# EAGLE design controller-ha-v4-rev1 (EAGLE 6.5.0)
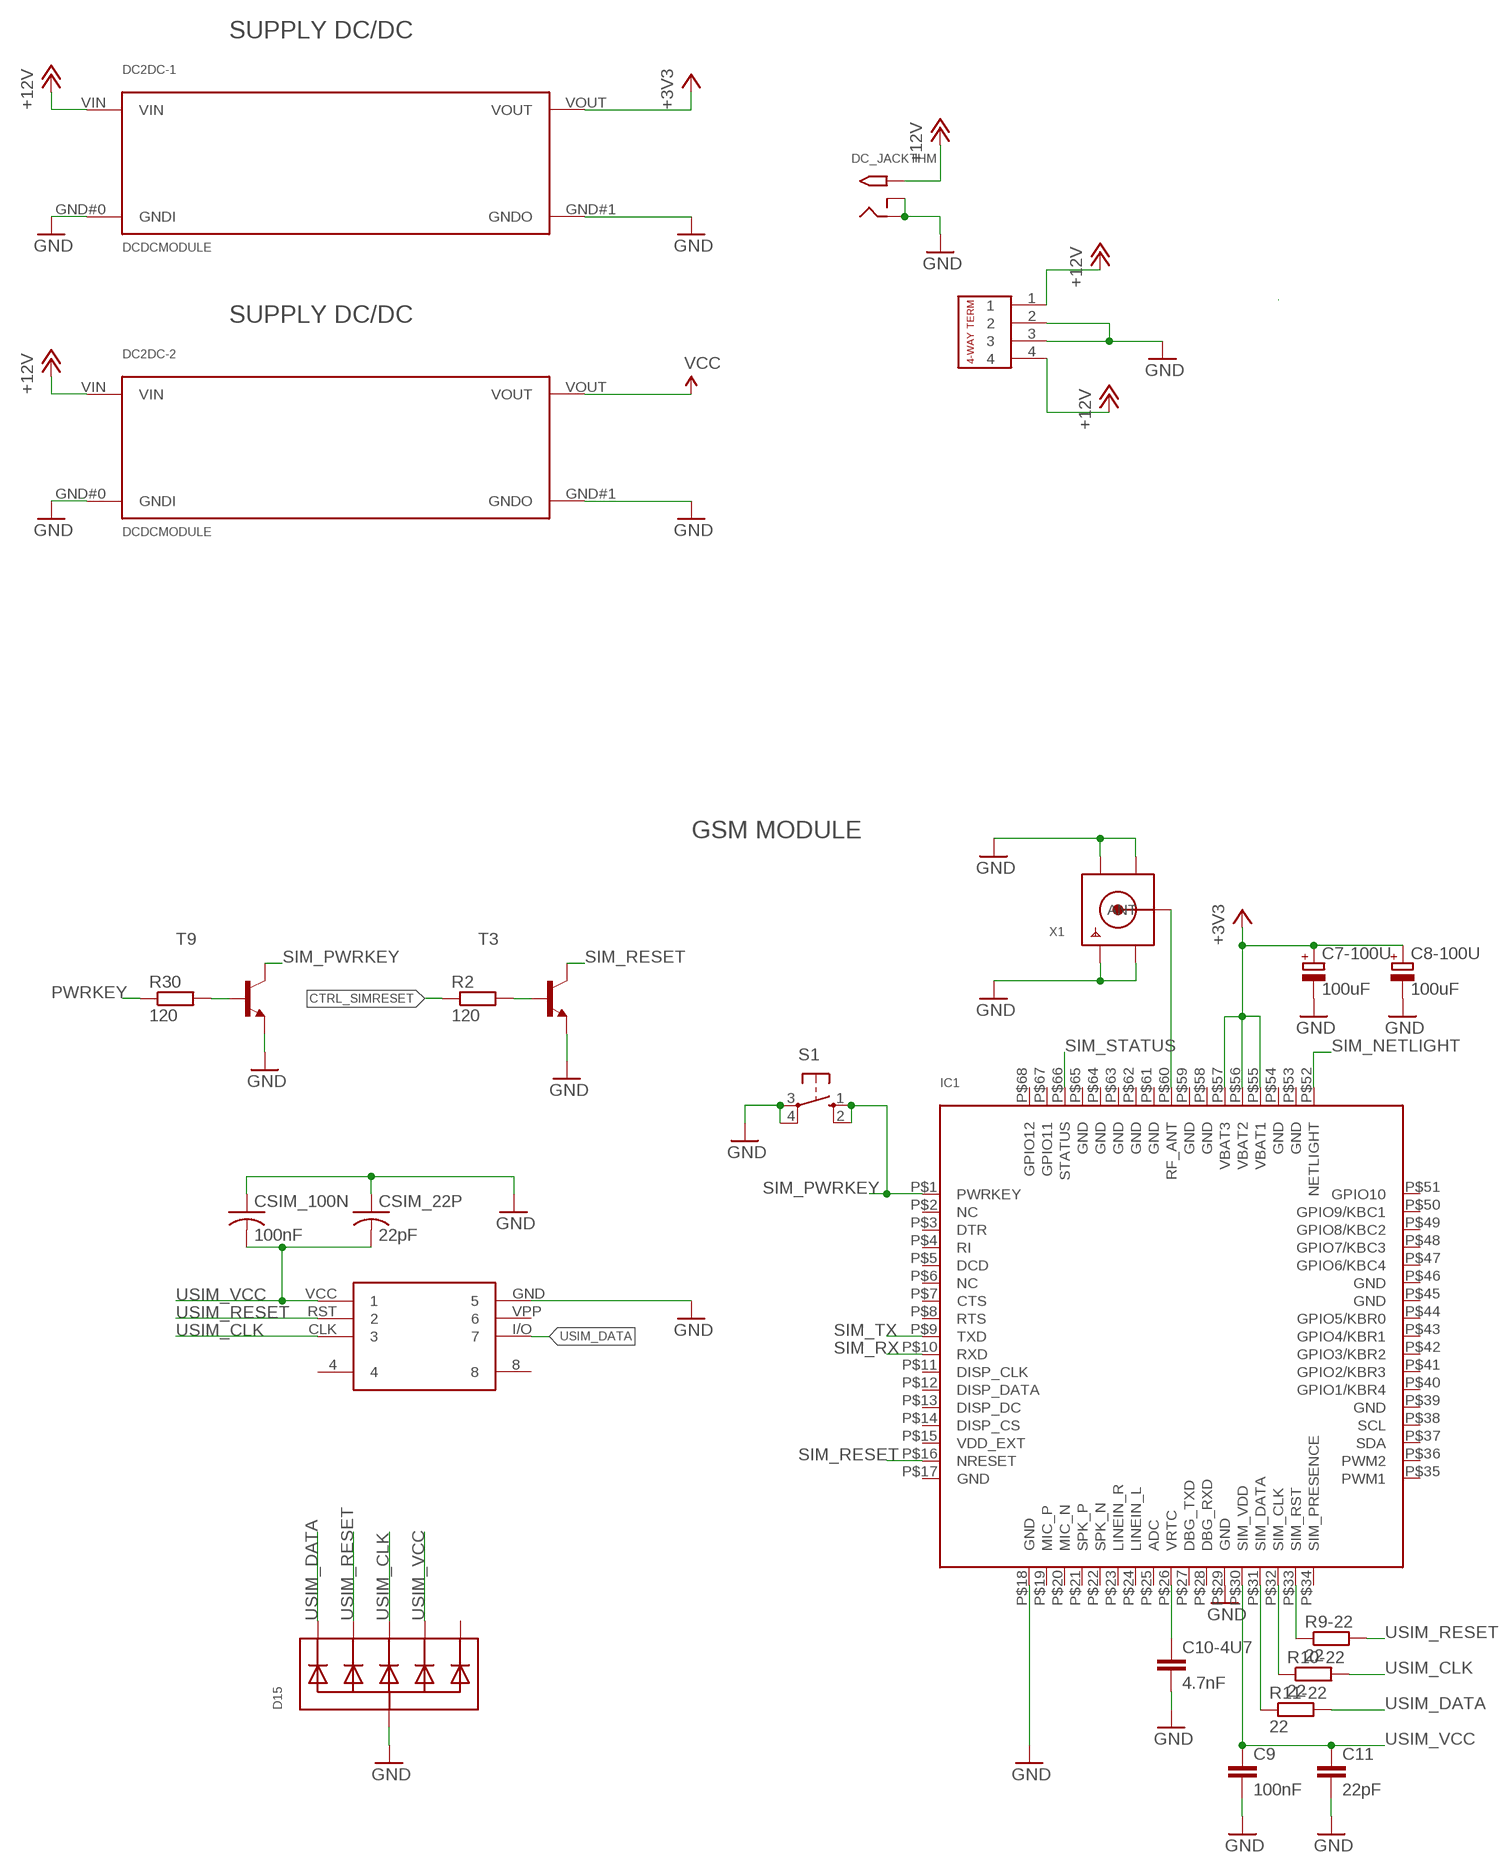
[diagram p0: schematic, sheet 1, part 1 of 2]
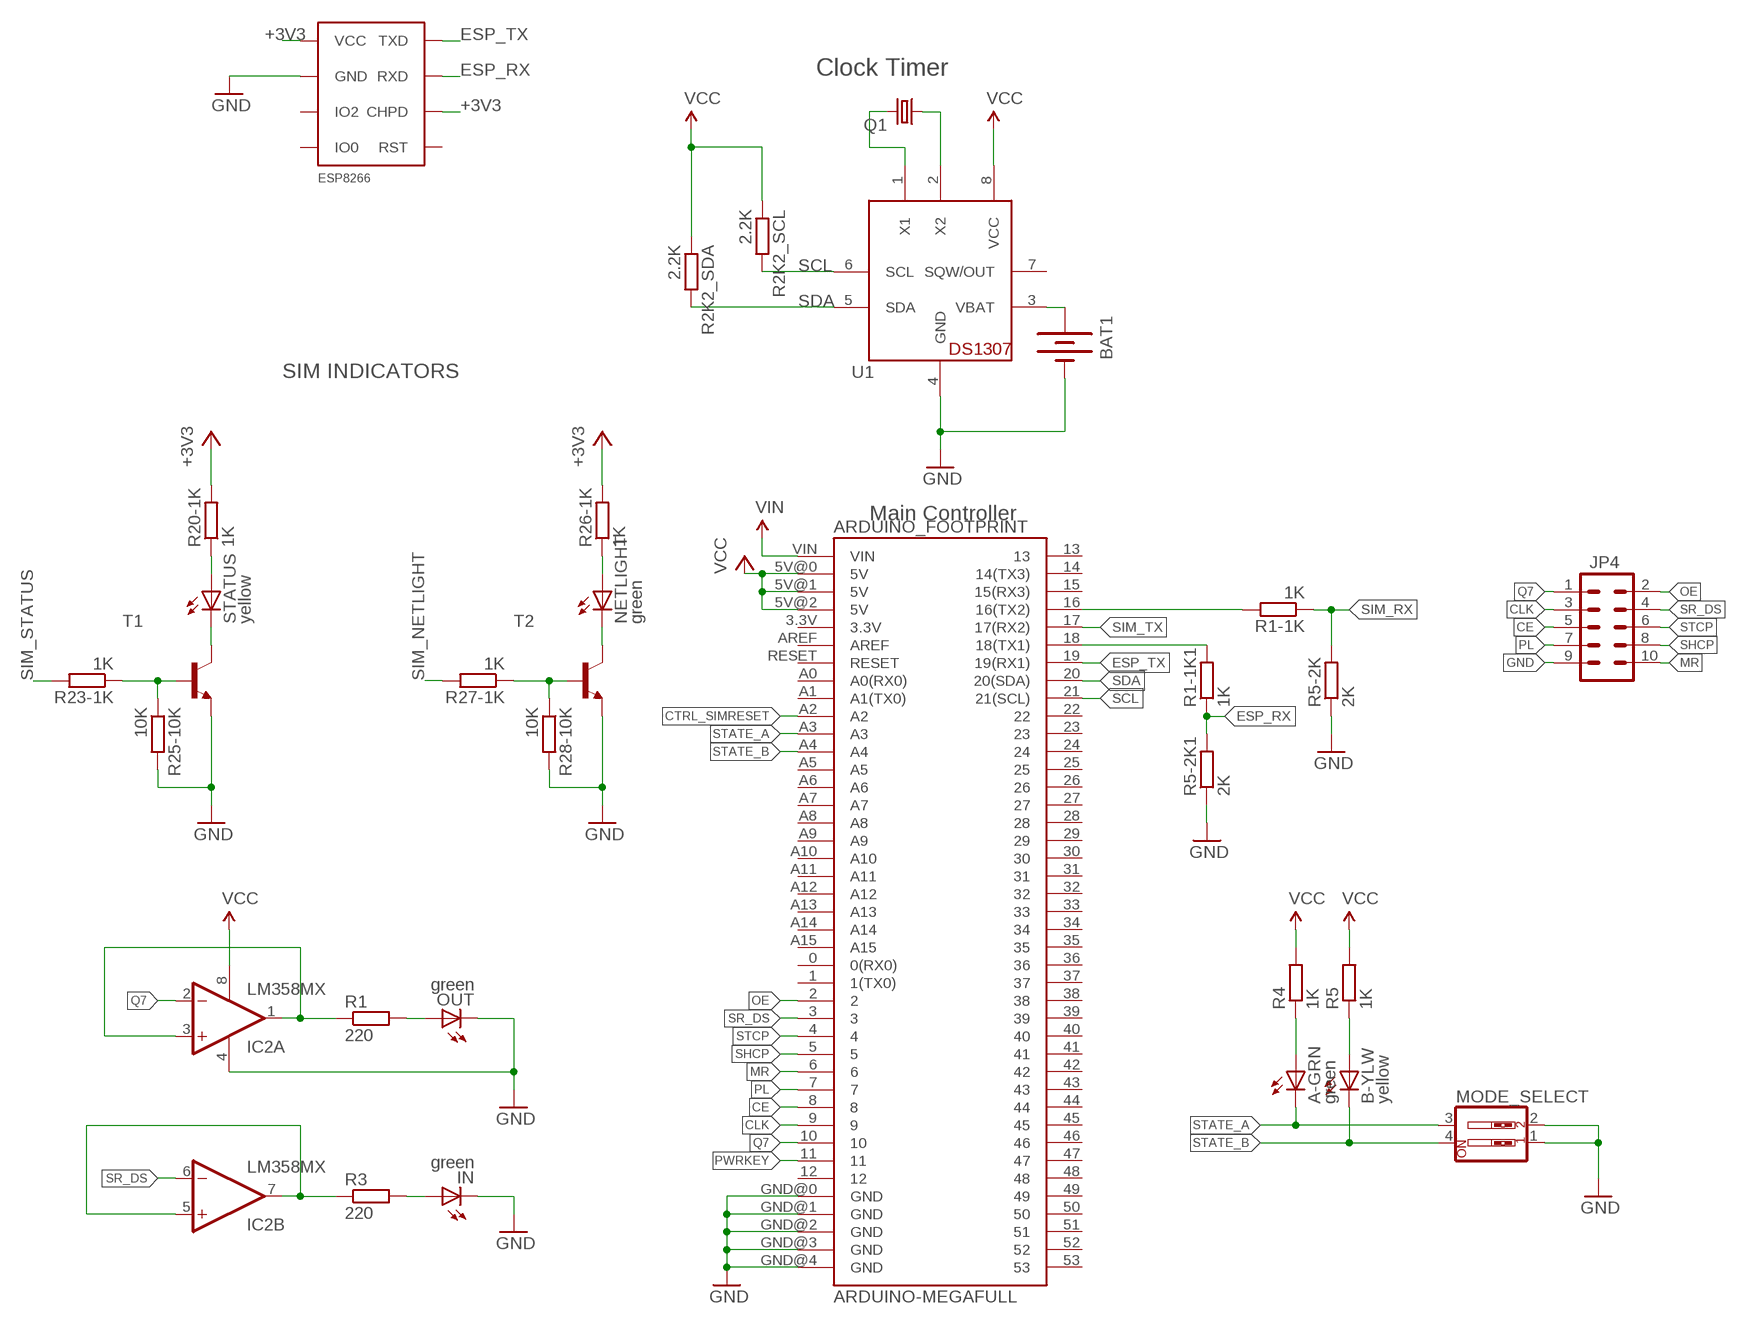
[diagram p1: schematic, sheet 1, part 2 of 2]

## Parts
4-WAY_L-TERMINAL  4-PIN-CON-1759017  [4-PIN-CON-1759017]
A-GRN  green  LEDCHIP-LED0805  [CHIP-LED0805]
ARDUINO_FOOTPRINT  ARDUINO-MEGAFULL  [ARDUINO_MEGA]
B-YLW  yellow  LEDCHIP-LED0805  [CHIP-LED0805]
BAT1  BATTERY20PTH  [BATTCOM_20MM_PTH]
C7-100U  100uF  CPOL-EU153CLV-0605  [153CLV-0605]
C8-100U  100uF  CPOL-EU153CLV-0605  [153CLV-0605]
C9  100nF  C-EUC0603  [C0603]
C10-4U7  4.7nF  C-EUC0603  [C0603]
C11  22pF  C-EUC0603  [C0603]
CSIM_22P  22pF  C-USC0603K  [C0603K]
CSIM_100N  100nF  C-USC0603K  [C0603K]
D15  TVSARRAY_5LANE  [SOT363]
DC2DC-1  DCDCMODULE  [DCDCMODULE]
DC2DC-2  DCDCMODULE  [DCDCMODULE]
DC_JACKTHM  2.1MMJACKTHM  [PJ-102A]
ESP8266  ESP8266  [ESP8266]
IC1  GSM_SIM900_LITERAL  [SIM900_SMT]
IC2  LM358MX  [SO08]
IN  green  LEDCHIPLED_0805  [CHIPLED_0805]
JP4  M05X2RA  [2X5-RA]
MODE_SELECT  SW_DIP-2  [EDG-02]
NETLIGHT  green  LEDCHIP-LED0805  [CHIP-LED0805]
OUT  green  LEDCHIPLED_0805  [CHIPLED_0805]
Q1  CRYSTALTC26H  [TC26H]
R1  220  R-EU_R0805  [R0805]
R1-1K  1K  R-EU_R0603  [R0603]
R1-1K1  1K  R-EU_R0603  [R0603]
R2  120  R-EU_M0805  [M0805]
R2K2_SCL  2.2K  R-EU_R0603  [R0603]
R2K2_SDA  2.2K  R-EU_R0603  [R0603]
R3  220  R-EU_R0805  [R0805]
R4  1K  R-EU_R0805  [R0805]
R5  1K  R-EU_R0805  [R0805]
R5-2K  2K  R-EU_R0603  [R0603]
R5-2K1  2K  R-EU_R0603  [R0603]
R9-22  22  R-EU_R0603  [R0603]
R10-22  22  R-EU_R0603  [R0603]
R11-22  22  R-EU_R0603  [R0603]
R20-1K  1K  R-EU_R0603  [R0603]
R23-1K  1K  R-EU_R0603  [R0603]
R25-10K  10K  R-EU_R0603  [R0603]
R26-1K  1K  R-EU_R0603  [R0603]
R27-1K  1K  R-EU_R0603  [R0603]
R28-10K  10K  R-EU_R0603  [R0603]
R30  120  R-EU_M0805  [M0805]
S1  10-XX  [B3F-10XX]
SIM_HOLDER  SIM_HOLDER_PUSH  [SIM_HOLDER_PUSH]
STATUS  yellow  LEDCHIP-LED0805  [CHIP-LED0805]
T1  MMBT2222ALT1-NPN-SOT23-BEC  [SOT23-BEC]
T2  MMBT2222ALT1-NPN-SOT23-BEC  [SOT23-BEC]
T3  MMBT2222ALT1-NPN-SOT23-BEC  [SOT23-BEC]
T9  MMBT2222ALT1-NPN-SOT23-BEC  [SOT23-BEC]
U1  DS1307  [DIL08]
X1  SMACONNECTOR  [SMA90_DIP]

## Nets
+3V3 [power]: C7-100U.+ C8-100U.+ DC2DC-1.VOUT ESP8266.CHPD ESP8266.VCC IC1.P$55(VBAT1) IC1.P$56(VBAT2) IC1.P$57(VBAT3) R20-1K.2 R26-1K.2
+12V [power]: 4-WAY_L-TERMINAL.1 4-WAY_L-TERMINAL.4 DC2DC-1.VIN DC2DC-2.VIN DC_JACKTHM.TIP
CE: ARDUINO_FOOTPRINT.8 JP4.5
CLK: ARDUINO_FOOTPRINT.9 JP4.3
CTRL_SIMRESET: ARDUINO_FOOTPRINT.A2 R2.1
ESP_RX: ESP8266.RXD R1-1K1.1 R5-2K1.2
ESP_TX: ARDUINO_FOOTPRINT.19(19(RX1)) ESP8266.TXD
GND [GND]: 4-WAY_L-TERMINAL.2 4-WAY_L-TERMINAL.3 ARDUINO_FOOTPRINT.GND@0(GND) ARDUINO_FOOTPRINT.GND@1(GND) ARDUINO_FOOTPRINT.GND@2(GND) ARDUINO_FOOTPRINT.GND@3(GND) ARDUINO_FOOTPRINT.GND@4(GND) BAT1.2(-) C7-100U.- C8-100U.- C9.2 C10-4U7.2 C11.2 CSIM_22P.1 CSIM_100N.1 D15.2(A) DC2DC-1.GND#0(GNDI) DC2DC-1.GND#1(GNDO) DC2DC-2.GND#0(GNDI) DC2DC-2.GND#1(GNDO) DC_JACKTHM.RING DC_JACKTHM.RING_SW ESP8266.GND IC1.P$18(GND) IC1.P$29(GND) IC2.4(P:V-) IN.C JP4.9 MODE_SELECT.1 MODE_SELECT.2 OUT.C R5-2K1.1 R5-2K.1 R25-10K.2 R28-10K.2 S1.3(P) S1.4(P1) SIM_HOLDER.GND T1.E T2.E T3.E T9.E U1.4(GND) X1.GND1 X1.GND2 X1.GND3 X1.GND4
MR: ARDUINO_FOOTPRINT.6 JP4.10
N$1: ARDUINO_FOOTPRINT.16(16(TX2)) R1-1K.2
N$2: IC1.P$31(SIM_DATA) R11-22.1
N$3: IC1.P$32(SIM_CLK) R10-22.1
N$4: IC1.P$33(SIM_RST) R9-22.1
N$5: C10-4U7.1 IC1.P$26(VRTC)
N$6: IC1.P$60(RF_ANT) X1.ANTENNA(ANT)
N$8: R20-1K.1 STATUS.A
N$9: STATUS.C T1.C
N$10: R23-1K.1 R25-10K.1 T1.B
N$11: NETLIGHT.A R26-1K.1
N$12: NETLIGHT.C T2.C
N$13: R27-1K.1 R28-10K.1 T2.B
N$14: R30.2 T9.B
N$15: R2.2 T3.B
N$16: Q1.1 U1.2(X2)
N$19: Q1.2 U1.1(X1)
N$20: ARDUINO_FOOTPRINT.18(18(TX1)) R1-1K1.2
N$21: IC2.1(A:OUT) IC2.3(A:+IN) R1.1
N$23: BAT1.1(+) U1.3(VBAT)
N$24: IC2.5(B:+IN) IC2.7(B:OUT) R3.1
N$25: OUT.A R1.2
N$26: IN.A R3.2
N$27: A-GRN.A R4.1
N$28: B-YLW.A R5.1
OE: ARDUINO_FOOTPRINT.2 JP4.2
PL: ARDUINO_FOOTPRINT.7 JP4.7
PWRKEY: ARDUINO_FOOTPRINT.11 R30.1
Q7: ARDUINO_FOOTPRINT.10 IC2.2(A:-IN) JP4.1
SCL: ARDUINO_FOOTPRINT.21(21(SCL)) R2K2_SCL.2 U1.6(SCL)
SDA: ARDUINO_FOOTPRINT.20(20(SDA)) R2K2_SDA.2 U1.5(SDA)
SHCP: ARDUINO_FOOTPRINT.5 JP4.8
SIM_NETLIGHT: IC1.P$52(NETLIGHT) R27-1K.2
SIM_PWRKEY: IC1.P$1(PWRKEY) S1.1(S) S1.2(S1) T9.C
SIM_RESET: IC1.P$16(NRESET) T3.C
SIM_RX: IC1.P$10(RXD) R1-1K.1 R5-2K.2
SIM_STATUS: IC1.P$66(STATUS) R23-1K.2
SIM_TX: ARDUINO_FOOTPRINT.17(17(RX2)) IC1.P$9(TXD)
SR_DS: ARDUINO_FOOTPRINT.3 IC2.6(B:-IN) JP4.4
STATE_A: A-GRN.C ARDUINO_FOOTPRINT.A3 MODE_SELECT.3
STATE_B: ARDUINO_FOOTPRINT.A4 B-YLW.C MODE_SELECT.4
STCP: ARDUINO_FOOTPRINT.4 JP4.6
USIM_CLK: D15.4(C3) R10-22.2 SIM_HOLDER.CLK
USIM_DATA: D15.1(C1) R11-22.2 SIM_HOLDER.I/O
USIM_RESET: D15.3(C2) R9-22.2 SIM_HOLDER.RST
USIM_VCC: C9.1 C11.1 CSIM_22P.2 CSIM_100N.2 D15.5(C4) IC1.P$30(SIM_VDD) SIM_HOLDER.VCC
VCC [power]: ARDUINO_FOOTPRINT.5V@0(5V) ARDUINO_FOOTPRINT.5V@1(5V) ARDUINO_FOOTPRINT.5V@2(5V) DC2DC-2.VOUT IC2.8(P:V+) R2K2_SCL.1 R2K2_SDA.1 R4.2 R5.2 U1.8(VCC)
VIN: ARDUINO_FOOTPRINT.VIN
Unconnected: ARDUINO_FOOTPRINT.0(0(RX0)) ARDUINO_FOOTPRINT.1(1(TX0)) ARDUINO_FOOTPRINT.3.3V ARDUINO_FOOTPRINT.12 ARDUINO_FOOTPRINT.13 ARDUINO_FOOTPRINT.14(14(TX3)) ARDUINO_FOOTPRINT.15(15(RX3)) ARDUINO_FOOTPRINT.22 ARDUINO_FOOTPRINT.23 ARDUINO_FOOTPRINT.24 ARDUINO_FOOTPRINT.25 ARDUINO_FOOTPRINT.26 ARDUINO_FOOTPRINT.27 ARDUINO_FOOTPRINT.28 ARDUINO_FOOTPRINT.29 ARDUINO_FOOTPRINT.30 ARDUINO_FOOTPRINT.31 ARDUINO_FOOTPRINT.32 ARDUINO_FOOTPRINT.33 ARDUINO_FOOTPRINT.34 ARDUINO_FOOTPRINT.35 ARDUINO_FOOTPRINT.36 ARDUINO_FOOTPRINT.37 ARDUINO_FOOTPRINT.38 ARDUINO_FOOTPRINT.39 ARDUINO_FOOTPRINT.40 ARDUINO_FOOTPRINT.41 ARDUINO_FOOTPRINT.42 ARDUINO_FOOTPRINT.43 ARDUINO_FOOTPRINT.44 ARDUINO_FOOTPRINT.45 ARDUINO_FOOTPRINT.46 ARDUINO_FOOTPRINT.47 ARDUINO_FOOTPRINT.48 ARDUINO_FOOTPRINT.49 ARDUINO_FOOTPRINT.50 ARDUINO_FOOTPRINT.51 ARDUINO_FOOTPRINT.52 ARDUINO_FOOTPRINT.53 ARDUINO_FOOTPRINT.A0(A0(RX0)) ARDUINO_FOOTPRINT.A1(A1(TX0)) ARDUINO_FOOTPRINT.A5 ARDUINO_FOOTPRINT.A6 ARDUINO_FOOTPRINT.A7 ARDUINO_FOOTPRINT.A8 ARDUINO_FOOTPRINT.A9 ARDUINO_FOOTPRINT.A10 ARDUINO_FOOTPRINT.A11 ARDUINO_FOOTPRINT.A12 ARDUINO_FOOTPRINT.A13 ARDUINO_FOOTPRINT.A14 ARDUINO_FOOTPRINT.A15 ARDUINO_FOOTPRINT.AREF ARDUINO_FOOTPRINT.RESET D15.6(C5) ESP8266.IO0 ESP8266.IO2 ESP8266.RST IC1.P$2(NC) IC1.P$3(DTR) IC1.P$4(RI) IC1.P$5(DCD) IC1.P$6(NC) IC1.P$7(CTS) IC1.P$8(RTS) IC1.P$11(DISP_CLK) IC1.P$12(DISP_DATA) IC1.P$13(DISP_DC) IC1.P$14(DISP_CS) IC1.P$15(VDD_EXT) IC1.P$19(MIC_P) IC1.P$20(MIC_N) IC1.P$21(SPK_P) IC1.P$22(SPK_N) IC1.P$23(LINEIN_R) IC1.P$24(LINEIN_L) IC1.P$25(ADC) IC1.P$27(DBG_TXD) IC1.P$28(DBG_RXD) IC1.P$34(SIM_PRESENCE) IC1.P$35(PWM1) IC1.P$36(PWM2) IC1.P$37(SDA) IC1.P$38(SCL) IC1.P$40(GPIO1/KBR4) IC1.P$41(GPIO2/KBR3) IC1.P$42(GPIO3/KBR2) IC1.P$43(GPIO4/KBR1) IC1.P$44(GPIO5/KBR0) IC1.P$47(GPIO6/KBC4) IC1.P$48(GPIO7/KBC3) IC1.P$49(GPIO8/KBC2) IC1.P$50(GPIO9/KBC1) IC1.P$51(GPIO10) SIM_HOLDER.4 SIM_HOLDER.8 SIM_HOLDER.VPP U1.7(SQW/OUT)

## Notes on the sheet
- SUPPLY DC/DC
- SUPPLY DC/DC
- Clock Timer
- GSM MODULE
- SIM INDICATORS
- Main Controller

## Power pins joined to a net without a drawn wire
GND: IC1.P$17(GND) IC1.P$39(GND) IC1.P$45(GND) IC1.P$46(GND) IC1.P$53(GND) IC1.P$54(GND) IC1.P$58(GND) IC1.P$59(GND) IC1.P$61(GND) IC1.P$62(GND) IC1.P$63(GND) IC1.P$64(GND) IC1.P$65(GND)
GPIO11: IC1.P$67(GPIO11)
GPIO12: IC1.P$68(GPIO12)

## Library data of the parts
4-WAY_L-TERMINAL = maul:4-PIN-CON-1759017
A-GRN B-YLW = led:LED: LED
ARDUINO_FOOTPRINT = SparkFun-Boards:ARDUINO-MEGA: Arduino Mega board footprint
BAT1 = SparkFun-Electromechanical:BATTERY: Battery Holders Various common sizes : AA, AAA, 20mm coin cell and 12mm coin cell. 20MM_4LEGS, BATT-10373
C7-100U C8-100U = rcl:CPOL-EU: POLARIZED CAPACITOR, European symbol
C9 C10-4U7 C11 = rcl:C-EU: CAPACITOR, European symbol
CSIM_22P CSIM_100N = rcl:C-US: CAPACITOR, American symbol
D15 = microbuilder:TVSARRAY_5LANE: Voltage Transient Suppressor Array SOT363 SMF05C - 100W 5V: Digikey - SMF05CT1GOSCT-ND
DC2DC-1 DC2DC-2 = bontor:DCDCMODULE
DC_JACKTHM = adafruit:2.1MMJACK: 2.1mm x 5.5mm THM DC jack with internal switch. Digikey part #PJ-102A, 4UCON part #05537 2.1mm x 5.5mm SMT DC jack with internal switch. Digikey part #PJ-002A-SMT, 4UCON part #03267 By microbuilder.eu & adafruit.com
ESP8266 = tigorcustom:ESP8266
IC1 = microbuilder:GSM_SIM900_LITERAL: SIM900 Quad-Band GSM/GPRS Module Power Supply: 3.2-4.8V Temperature Range: -30°C-+80°C Bands: GSM 850, EGSM 900, DCS 1800, PCS 1900
IC2 = linear:LM358: OP AMP also LM158; LM258; LM2904 Source: http://cache.national.com/ds/LM/LM158.pdf
IN NETLIGHT OUT STATUS = adafruit:LED: LED
JP4 = SparkFun-Connectors:M05X2: Header 5x2 Standard 10-pin dual row 0.1" header. Commonly used with AVR-ISP. Use with Spark Fun Electronics SKU: PRT-00778
MODE_SELECT = special:SW_DIP-2: DIP SWITCH
Q1 = crystal:CRYSTAL: CRYSTAL; OC_FARNELL: unknown; OC_NEWARK: unknown
R1-R5 R30 = resistor:R-EU_: RESISTOR, European symbol
R1-1K R1-1K1 R2K2_SCL R2K2_SDA R5-2K R5-2K1 R9-22 R10-22 R11-22 R20-1K R23-1K R25-10K R26-1K R27-1K R28-10K = rcl:R-EU_: RESISTOR, European symbol
S1 = switch-omron:10-XX: OMRON SWITCH; MPN: B3F-1000; OC_FARNELL: 176432; OC_NEWARK: 36M3542
SIM_HOLDER = maul:SIM_HOLDER_PUSH
T1 T2 = transistor:*-NPN-: NPN Transistror BF959 corrected 2008.03.06
T3 T9 = transistor-neu-to92:*-NPN-: NPN Transistror BF959 corrected 2008.03.06
U1 = adafruit:DS1307: DS1307 Real time clock (RTC) with battery backup ability. Talk to it via i2c
X1 = microbuilder:SMACONNECTOR: SMA Connector 90° DIP SMA Connector, 50 Ohm (4UConnector: 07259)

## Net classes
1 power: width 0.305 mm, drill 0.6 mm, clearance 0.813 mm
2 GND: width 0.305 mm, drill 0.6 mm, clearance 0.508 mm
3 LIVEAC: width 0.508 mm, drill 0.508 mm, clearance 1.27 mm

## Board
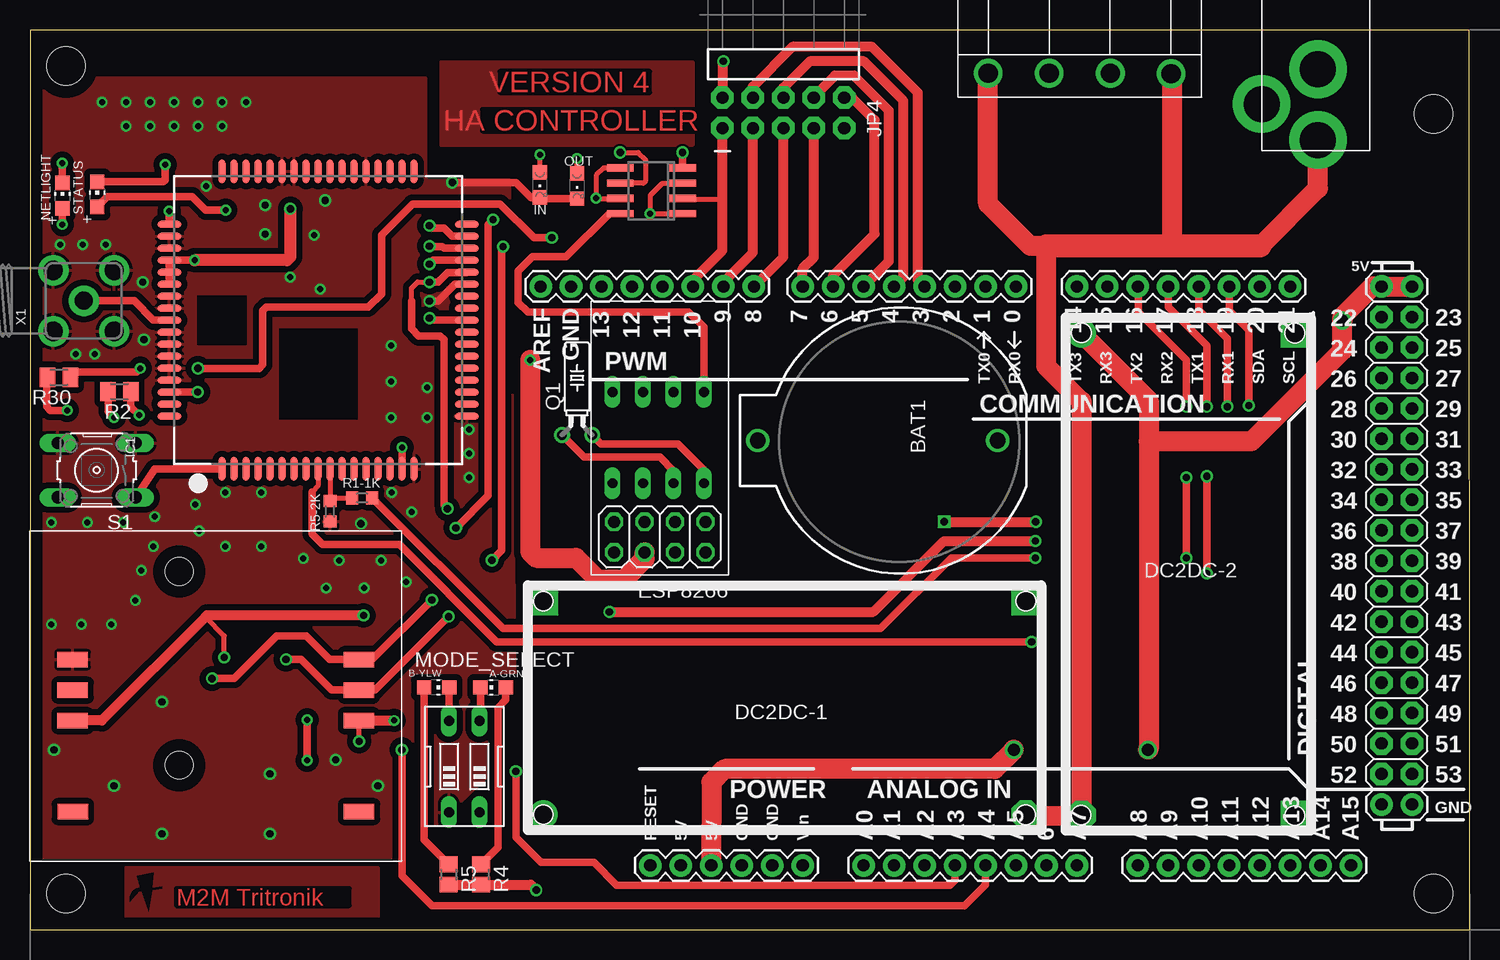
[diagram p2: board, top side]
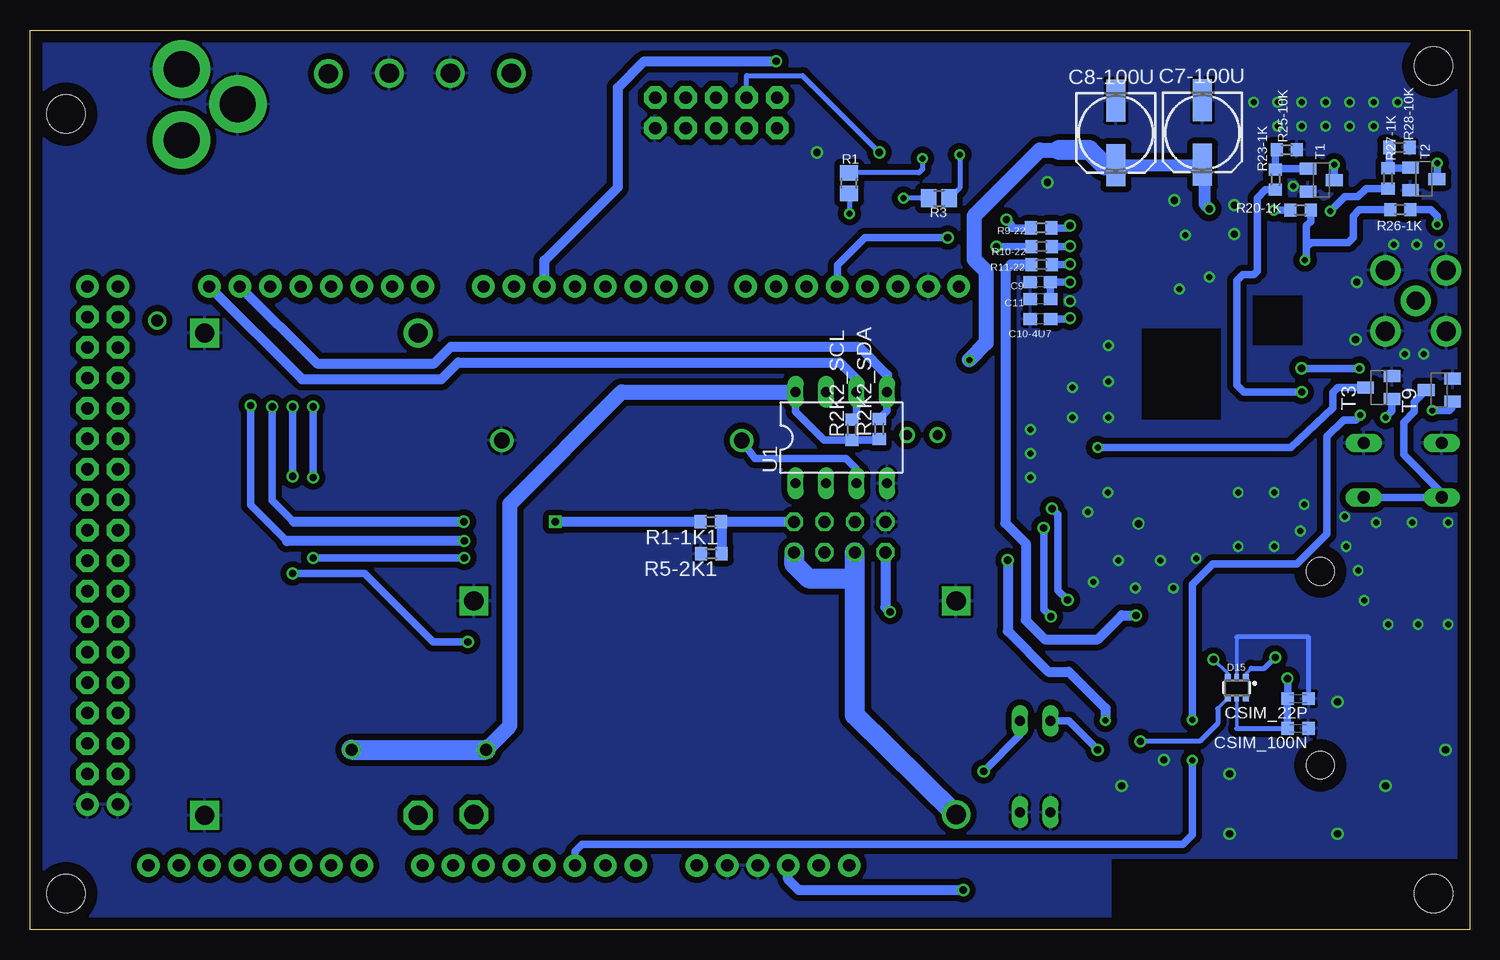
[diagram p3: board, bottom side, seen from below]

Size 120 x 75.01 mm. Coordinates in mm from the lower left corner, seen from the top.
Outline: 0,0 120,0 119.98,75.01 0,75 0,0
Copper layers (1*16): Top 0.035mm / dielectric 1.5mm / Bottom 0.035mm
Design rules "default": minimum track width 10mil, minimum drill 24mil, track to track 8mil, track to pad 8mil, pad to pad 8mil, via to via 8mil, smd to smd 8mil, copper to edge 40mil, drill to drill 8mil, minimum pad ring 10mil, minimum via ring 8mil, stop-mask expansion 4mil, vias tented up to drill 0mil, thermal gap 10mil
Holes 3.2 mm at 3,3 3,72 117,68 117,3

### Footprints (pad centres in the part's own frame; a part is rotated, then mirrored left to right if it is on the bottom)
4-PIN-CON-1759017 = drill 1.6: 1 -7.62,4.13; 2 -2.55,4.1; 3 2.55,4.1; 4 7.63,4.1
CHIP-LED0805 = smd 1.2 x 1.2: A 0,-1.05; C 0,1.05
ARDUINO_MEGA = drill 1.016 pad 1.88: 0 8.89,24.13; 1 6.35,24.13; 2 3.81,24.13; 3 1.27,24.13; 3.3V -19.05,-24.13; 4 -1.27,24.13; 5 -3.81,24.13; 5V@0 -16.51,-24.13; 5V@1 39.37,24.13; 5V@2 41.91,24.13; 6 -6.35,24.13; 7 -8.89,24.13; 8 -12.954,24.13; 9 -15.494,24.13; 10 -18.034,24.13; 11 -20.574,24.13; 12 -23.114,24.13; 13 -25.654,24.13; 14 13.97,24.13; 15 16.51,24.13; 16 19.05,24.13; 17 21.59,24.13; 18 24.13,24.13; 19 26.67,24.13; 20 29.21,24.13; 21 31.75,24.13; A0 -3.81,-24.13; A1 -1.27,-24.13; A2 1.27,-24.13; A3 3.81,-24.13; A4 6.35,-24.13; A5 8.89,-24.13; A6 11.43,-24.13; A7 13.97,-24.13; A8 19.05,-24.13; A9 21.59,-24.13; A10 24.13,-24.13; A11 26.67,-24.13; A12 29.21,-24.13; A13 31.75,-24.13; A14 34.29,-24.13; A15 36.83,-24.13; AREF -30.734,24.13; GND@0 -13.97,-24.13; GND@1 -11.43,-24.13; GND@2 39.37,-19.05; GND@3 41.91,-19.05; GND@4 -28.194,24.13; RESET -21.59,-24.13; VIN -8.89,-24.13 | drill 1.016 pad 1.88 octagon: 22 39.37,21.59; 23 41.91,21.59; 24 39.37,19.05; 25 41.91,19.05; 26 39.37,16.51; 27 41.91,16.51; 28 39.37,13.97; 29 41.91,13.97; 30 39.37,11.43; 31 41.91,11.43; 32 39.37,8.89; 33 41.91,8.89; 34 39.37,6.35; 35 41.91,6.35; 36 39.37,3.81; 37 41.91,3.81; 38 39.37,1.27; 39 41.91,1.27; 40 39.37,-1.27; 41 41.91,-1.27; 42 39.37,-3.81; 43 41.91,-3.81; 44 39.37,-6.35; 45 41.91,-6.35; 46 39.37,-8.89; 47 41.91,-8.89; 48 39.37,-11.43; 49 41.91,-11.43; 50 39.37,-13.97; 51 41.91,-13.97; 52 39.37,-16.51; 53 41.91,-16.51
BATTCOM_20MM_PTH = drill 1.3: 1 11.85,0; 2 -8.15,0
153CLV-0605 = smd 3.5 x 1.6: + 2.7,0; - -2.7,0
C0603 = smd 1.1 x 1: 1 -0.85,0; 2 0.85,0
C0603K = smd 1.05 x 1.08: 1 -0.875,0; 2 0.875,0
SOT363 = smd 0.5 x 0.5: 1 -0.75,-0.9; 3 0.75,-0.9; 4 0.75,0.9; 6 -0.75,0.9 | smd 0.4 x 0.5: 2 0,-0.9; 5 0,0.9
DCDCMODULE = drill 1.6 square: GND#0 -20.08,-8.82; GND#1 20.12,-8.82 | drill 1.6 octagon: VIN -20.08,8.98 | drill 1.6: VOUT 20.12,8.98
PJ-102A = drill 3 pad 4.8: RING 0.1,-3.39; RING_SW -4.6,-6.29; TIP 0.1,-9.29
ESP8266 = drill 1.016 octagon: CHPD 1.27,1.27; GND 3.81,-1.27; IO0 -1.27,-1.27; IO2 1.27,-1.27; RST -1.27,1.27; RXD -3.81,-1.27; TXD 3.81,1.27; VCC -3.81,1.27
SIM900_SMT = smd 2 x 0.6: P$1 -12.4,8; P$2 -12.4,7; P$3 -12.4,6; P$4 -12.4,5; P$5 -12.4,4; P$6 -12.4,3; P$7 -12.4,2; P$8 -12.4,1; P$9 -12.4,0; P$10 -12.4,-1; P$11 -12.4,-2; P$12 -12.4,-3; P$13 -12.4,-4; P$14 -12.4,-5; P$15 -12.4,-6; P$16 -12.4,-7; P$17 -12.4,-8; P$35 12.4,-8; P$36 12.4,-7; P$37 12.4,-6; P$38 12.4,-5; P$39 12.4,-4; P$40 12.4,-3; P$41 12.4,-2; P$42 12.4,-1; P$43 12.4,0; P$44 12.4,1; P$45 12.4,2; P$46 12.4,3; P$47 12.4,4; P$48 12.4,5; P$49 12.4,6; P$50 12.4,7; P$51 12.4,8 | smd 0.6 x 2: P$18 -8,-12.4; P$19 -7,-12.4; P$20 -6,-12.4; P$21 -5,-12.4; P$22 -4,-12.4; P$23 -3,-12.4; P$24 -2,-12.4; P$25 -1,-12.4; P$26 0,-12.4; P$27 1,-12.4; P$28 2,-12.4; P$29 3,-12.4; P$30 4,-12.4; P$31 5,-12.4; P$32 6,-12.4; P$33 7,-12.4; P$34 8,-12.4; P$52 8,12.4; P$53 7,12.4; P$54 6,12.4; P$55 5,12.4; P$56 4,12.4; P$57 3,12.4; P$58 2,12.4; P$59 1,12.4; P$60 0,12.4; P$61 -1,12.4; P$62 -2,12.4; P$63 -3,12.4; P$64 -4,12.4; P$65 -5,12.4; P$66 -6,12.4; P$67 -7,12.4; P$68 -8,12.4
SO08 = smd 0.6 x 2.2: 1 -1.905,-2.6; 2 -0.635,-2.6; 3 0.635,-2.6; 4 1.905,-2.6; 5 1.905,2.6; 6 0.635,2.6; 7 -0.635,2.6; 8 -1.905,2.6
CHIPLED_0805 = smd 1.2 x 1.2: A 0,-1.05; C 0,1.05
2X5-RA = drill 1.016 pad 1.88 octagon: 1 -1.27,5.08; 2 1.27,5.08; 3 -1.27,2.54; 4 1.27,2.54; 5 -1.27,0; 6 1.27,0; 7 -1.27,-2.54; 8 1.27,-2.54; 9 -1.27,-5.08; 10 1.27,-5.08
EDG-02 = drill 0.813 long: 1 -1.27,-3.81; 2 1.27,-3.81; 3 1.27,3.81; 4 -1.27,3.81
TC26H = drill 0.813: 1 -1.27,0; 2 1.27,0
R0805 = smd 1.3 x 1.5: 1 -0.85,0; 2 0.85,0
R0603 = smd 1 x 1.1: 1 -0.85,0; 2 0.85,0
M0805 = smd 1.3 x 1.6: 1 -0.95,0; 2 0.95,0
B3F-10XX = drill 1.016 long: 1 -3.251,2.261; 2 3.251,2.261; 3 -3.251,-2.261; 4 3.251,-2.261
SIM_HOLDER_PUSH = smd 2.54 x 1.27: 4 12.066,-9.814; 8 -11.804,-9.814; CLK 12.046,-2.214; GND -11.824,2.866; I/O -11.824,-2.214; RST 12.046,0.326; VCC 12.046,2.866; VPP -11.824,0.326 | hole 2.3: -2.924,10.216; -2.934,-5.934
SOT23-BEC = smd 1 x 1.4: B -0.95,-1.1; C 0,1.1; E 0.95,-1.1
DIL08 = drill 0.813 long: 1 -3.81,-3.81; 2 -1.27,-3.81; 3 1.27,-3.81; 4 3.81,-3.81; 5 3.81,3.81; 6 1.27,3.81; 7 -1.27,3.81; 8 -3.81,3.81
SMA90_DIP = drill 1.5 pad 2.54: ANTENNA 0,0 | drill 1.6 pad 2.54: GND1 -2.54,2.54; GND2 2.54,2.54; GND3 -2.54,-2.54; GND4 2.54,-2.54

### Placement (x,y rotation side)
4-WAY_L-TERMINAL  87.5,75.5 180 top
A-GRN  38.6,20.2 90 top
ARDUINO_FOOTPRINT  73.3,29.49 0 top
B-YLW  33.9,20.2 270 top
BAT1  72.52,40.78 180 top
C7-100U  22.26,66.47 270 bottom
C8-100U  29.48,66.43 270 bottom
C9  35.78,54.01 180 bottom
C10-4U7  35.77,50.91 180 bottom
C11  35.77,52.59 180 bottom
CSIM_22P  14.29,19.26 180 bottom
CSIM_100N  14.3,16.78 180 bottom
D15  19.41,20.17 180 bottom
DC2DC-1  62.92,18.58 180 top
DC2DC-2  96.63,29.62 90 top
DC_JACKTHM  107.27,75.13 0 top
ESP8266  52.5,32.73 180 top
IC1  24.02,50.82 90 top
IC2  51.8,61.6 90 top
IN  42.5,62.1 180 top
JP4  62.8,68.1 90 top
MODE_SELECT  36.2,13.6 0 top
NETLIGHT  2.7,61.2 0 top
OUT  45.6,62 180 top
Q1  45.61,41.24 0 top
R1  51.72,62.24 90 bottom
R1-1K  27.69,36 0 top
R1-1K1  63.25,34.01 180 bottom
R2  7.46,44.86 180 top
R2K2_SCL  51.49,41.67 90 bottom
R2K2_SDA  49.21,41.74 90 bottom
R3  44.22,60.97 0 bottom
R4  37.6,4.6 270 top
R5  34.9,4.6 270 top
R5-2K  25.01,34.87 90 top
R5-2K1  63.2,31.34 0 bottom
R9-22  35.71,58.51 180 bottom
R10-22  35.67,56.96 180 bottom
R11-22  35.68,55.46 180 bottom
R20-1K  14.1,59.99 0 bottom
R23-1K  16.18,62.53 270 bottom
R25-10K  15.23,65.02 0 bottom
R26-1K  5.77,60.03 180 bottom
R27-1K  6.8,62.64 270 bottom
R28-10K  5.84,65.22 0 bottom
R30  2.41,46.05 180 top
S1  5.56,38.31 180 top
SIM_HOLDER  15.37,19.65 0 top
STATUS  5.6,61.3 0 top
T1  12.36,62.49 270 bottom
T2  3.82,62.59 270 bottom
T3  7.56,45.2 90 bottom
T9  2.51,45 90 bottom
U1  52.37,41.02 0 bottom
X1  4.48,52.43 90 top

### Tracks (layer width: path | path; a pad name or v marks a point on that pad's centre or on a via)
+3V3  (via drill 0.5, 0.6)
  Top 0.61: v13.71,55.82 IC1.P$55 IC1.P$56 | IC1.P$56 11.6,54.8 | IC1.P$56 IC1.P$57
  Top 1.016: v21.7,60.1 21.7,56.1 21.42,55.82 v13.71,55.82
  Top 1.676: v41.7,47.5 41.7,31.5 42.2,31 45.5,31 47.3,29.2 49.5,29.2 51.23,30.93 ESP8266.CHPD
  Bottom 0.61: R26-1K.2 9.17,60.03 9.7,59.5 9.7,57.7 10.1,57.3 13.2,57.3 13.6,56.9 | 13.6,56.9 13.6,55.93 v13.71,55.82 | C7-100U.+ 22.17,63.77 22.1,63.7 | R20-1K.2 13.25,59.05 13.6,58.7 13.6,56.9
  Bottom 1.016: C8-100U.+ 22.3,63.73 C7-100U.+ | 22.1,63.7 22.1,60.5 v21.7,60.1
  Bottom 1.27: v41.7,47.5 40.3,48.9 40.3,54.9 41.3,55.9 41.3,59.5 35.83,65.01 34.2,64.99
  Bottom 1.676: DC2DC-1.VOUT 51.23,17.89 51.23,29.3 | 51.23,29.3 ESP8266.CHPD | ESP8266.VCC 56.31,30.51 55.1,29.3 51.23,29.3 | C8-100U.+ 30.43,63.73 31.7,65 34.2,64.99
+12V
  Top 0.61: 4-WAY_L-TERMINAL.1 95.1,71.37
  Top 1.676: DC2DC-1.VIN 83.2,9.5 DC2DC-2.VIN 87.66,44.05 84.7,47.01 84.7,57 83.4,57 79.87,60.53 4-WAY_L-TERMINAL.4 | 102.56,57.01 107.37,61.82 DC_JACKTHM.TIP | 95.2,57.01 95.2,70.9 95.12,70.98 4-WAY_L-TERMINAL.1
  Top 1.93: 102.56,57.01 95.2,57.01 84.7,57
CE
  Top 0.813: ARDUINO_FOOTPRINT.8 62.8,56.07 JP4.5
CLK
  Top 0.813: ARDUINO_FOOTPRINT.9 57.81,54.01 60.26,56.46 JP4.3
CTRL_SIMRESET  (via drill 0.5)
  Top 0.61: R2.1 8.41,43.59 v9.1,42.9 | v23.1,17.5 v23.1,14.1
  Bottom 0.61: v9.1,42.9 9.5,42.5 10.5,42.5 11.9,41.1 11.9,33 14.4,30.5 21.4,30.5 23.1,28.8 v23.1,17.5 | ARDUINO_FOOTPRINT.A2 74.58,6.52 74,7.1 23.9,7.1 23.1,7.9 v23.1,14.1
ESP_RX
  Bottom 0.813: ESP8266.RXD R1-1K1.1 62.35,33.96 R5-2K1.2
ESP_TX  (via drill 0.6)
  Top 0.61: v101.6,43.7 101.6,50 99.97,51.63 ARDUINO_FOOTPRINT.19
  Top 0.813: v48.3,26.5 70.3,26.5 76.2,32.4 v83.8,32.4
  Bottom 0.61: 98.6,32.4 101.6,35.4 v101.6,43.7
  Bottom 0.813: ESP8266.TXD 48.69,26.89 v48.3,26.5 | v83.8,32.4 98.6,32.4
GND  (via drill 0.5, 0.6)
  Top 0.406: IC2.4
  Top 0.61: IC1.P$29 35.42,53.82 34,52.4 v33.3,52.4 | v35.2,62.3 40.5,62.3 41.75,61.05 IN.C 42.6,60.95 OUT.C | IC2.4 v54.4,64.8
  Bottom 0.305: 19.41,24.4 D15.2
  Bottom 0.406: CSIM_22P.1 13.41,24.4 19.41,24.4
  other vias: 3.8,48 5.4,48 9.5,49.2 9.4,54 6.3,57.1 4.4,57.1 2.5,57.1 6,69 8,69 10,69 12,69 14,69 16,69 18,69 8,67 10,67 12,67 14,67 16,67 24.6,60.8 23.7,57.9 33.1,42.7 30.1,45.7 24.2,53.4 14.7,62 36.6,41.7 36.6,39.7 36.6,37.7 21.7,54.4 30.1,42.7 30.1,48.7 33.1,45.2 31.8,34.82 27.59,33.85 30.14,36.46 13.79,35.45 14.09,33.25 16.29,31.95 19.29,31.95 16.29,36.45 19.29,36.45 22.79,30.95 25.76,30.79 29.26,30.79 31.36,28.99 27.84,28.49 24.69,28.47 10.41,34.43 1.79,25.45 4.29,25.45 6.79,25.45 8.79,27.45 10.29,31.95 9.29,29.95 1.79,33.95 4.79,33.95 7.79,33.95 25.49,14.15 2,15 7,12 11,8 20,8 20,13 11,19 29,12 19.6,58 19.6,60.4
  pour Top: 33,62.5 33,71 0,71 0,6 31,6 40.5,15 40,62.5
  pour Bottom: 0,6 30,6 30,0 120,0 120.01,75.03 0.04,75
GNDA
  cutout Top: 20.75,42.55 20.75,50.1 27.3,50.1 27.3,42.55
  cutout Top: 13.95,48.75 13.95,52.85 18.05,52.85 18.05,48.75
  cutout Bottom: 13.95,48.75 13.95,52.85 18.05,52.85 18.05,48.75
  cutout Bottom: 20.75,42.55 27.3,42.55 27.3,50.1 20.75,50.1
MR
  Top 0.813: ARDUINO_FOOTPRINT.6 66.95,54.55 70.4,58 70.4,67.5 68.53,69.37 JP4.10
N$1  (via drill 0.6)
  Top 0.61: R1-1K.2 39.44,25.1 70.9,25.1 76.8,31 v83.8,31 | v96.4,31 v96.4,37.7 | v96.4,43.6 96.4,47.5 92.4,51.5 92.4,53.57 ARDUINO_FOOTPRINT.16
  Bottom 0.61: v83.8,31 v96.4,31 | v96.4,37.7 v96.4,43.6
N$2  (via drill 0.6)
  Top 0.61: v33.3,55.5 33.62,55.82 IC1.P$31
  Bottom 0.61: R11-22.1 33.34,55.46 v33.3,55.5
N$3  (via drill 0.6)
  Top 0.61: v33.3,57 33.34,56.96 34.36,56.96 34.5,56.82 IC1.P$32
  Bottom 0.61: R10-22.1 33.34,56.96 v33.3,57
N$4  (via drill 0.6)
  Top 0.61: v33.3,58.7 33.5,58.5 34.5,58.5 35.18,57.82 IC1.P$33
  Bottom 0.61: R9-22.1 33.49,58.51 v33.3,58.7
N$5  (via drill 0.6)
  Top 0.61: v33.3,51 33.48,50.82 IC1.P$26
  Bottom 0.61: C10-4U7.1 33.39,50.91 v33.3,51
N$6
  Top 0.61: X1.ANTENNA 8.67,52.43 10.28,50.82 IC1.P$60
N$8  (via drill 0.5)
  Top 0.61: STATUS.A 6.45,61.1 13.54,61.1 14.65,59.99 v16.29,59.99 v16.3,60
  Bottom 0.61: v16.3,60 15.36,60 R20-1K.1
N$9  (via drill 0.5)
  Top 0.61: STATUS.C 11.12,62.35 T1.C v11.26,63.78
  Bottom 0.61: v11.26,63.78 T1.C
N$10
  Bottom 0.61: R25-10K.1 16.18,64.92 R23-1K.1 16.12,63.44 T1.B
N$11  (via drill 0.5)
  Top 0.61: NETLIGHT.A v2.7,58.8
  Bottom 0.61: v2.7,58.8 2.7,59.5 3.23,60.03 R26-1K.1
N$12  (via drill 0.5)
  Top 0.61: v2.7,63.9 NETLIGHT.C
  Bottom 0.61: T2.C 2.7,62.61 v2.7,63.9
N$13
  Bottom 0.61: T2.B 4.97,63.49 R27-1K.1 6.69,63.6 R28-10K.1
N$14  (via drill 0.5)
  Top 0.61: v3.1,43.3 1.7,43.3 1.4,43.6 1.4,45.99 R30.2
  Bottom 0.61: T9.B 1.45,44.05 1.5,44 1.5,43.5 1.7,43.3 v3.1,43.3
N$15  (via drill 0.5)
  Top 0.61: R2.2 6.51,43.19 v7,42.7
  Bottom 0.61: v7,42.7 6.46,43.24 T3.B
N$16
  Top 0.61: Q1.1 46.18,39.4 52.5,39.4 53.64,38.26 U1.2
N$18
  pour Top: 8,5.2 29,5.2 29,-0.1 8,-0.1
N$19
  Top 0.61: Q1.2 47.62,40.5 54,40.5 56.18,38.32 U1.1
N$20  (via drill 0.6)
  Top 0.61: v99.8,43.6 99.8,49.3 97.43,51.67 ARDUINO_FOOTPRINT.18
  Top 0.813: v76.21,34.01 v83.84,34.01
  Bottom 0.61: 98.01,34.01 99.8,35.8 v99.8,43.6
  Bottom 0.813: R1-1K1.2 v76.21,34.01 | v83.84,34.01 98.01,34.01
N$21  (via drill 0.5)
  Top 0.406: IC2.1 v51.7,59.7 51.7,61.2 52.7,62.2 54.37,62.2 IC2.3
  Bottom 0.406: R1.1 51.7,61.37 v51.7,59.7
N$22
  pour Top: 55.25,65.37 34.25,65.37 34.25,72.37 55.25,72.37
N$23
  Bottom 0.61: U1.3 51.1,38.4 52,39.3 59.55,39.3 BAT1.1
N$24  (via drill 0.5)
  Top 0.406: IC2.7 47.23,60.97 v47.2,61 47.2,62.9 47.8,63.51 IC2.5
  Bottom 0.406: R3.1 45.1,61 v47.2,61
N$25  (via drill 0.5)
  Top 0.406: OUT.A v45.6,64.3
  Bottom 0.406: v45.6,64.3 45.6,63.4 45.9,63.1 R1.2
N$26  (via drill 0.5)
  Top 0.406: IN.A v42.5,64.6
  Bottom 0.406: v42.5,64.6 42.5,61.84 R3.2
N$27
  Top 0.61: A-GRN.A 39.65,19.15 39,18.5 39,6.85 R4.1
N$28
  Top 0.61: B-YLW.A 32.85,7.5 R5.1
OE  (via drill 0.6)
  Top 0.813: v57.8,72.4 57.72,72.32 JP4.2
  Bottom 0.813: ARDUINO_FOOTPRINT.2 77.11,55.79 71,61.9 71,70.2 68.8,72.4 v57.8,72.4
PL
  Top 0.813: ARDUINO_FOOTPRINT.7 64.41,55.11 65.34,56.04 JP4.7
PWRKEY  (via drill 0.5, 0.6)
  Top 0.61: R30.1 3.81,46.5 8.9,46.5 v9.2,46.8 | v14,46.8 19.1,46.8 19.4,47.1 19.4,51.6 19.7,51.9 28.2,51.9 29.3,53 29.3,57.9 31.9,60.5 39.2,60.5 42,57.7 v43.5,57.7
  Bottom 0.61: v9.2,46.8 v14,46.8 | v43.5,57.7 50.4,57.7 52.7,55.4 52.7,53.65 ARDUINO_FOOTPRINT.11
Q7
  Top 0.406: IC2.2 54.47,60.9 57.72,60.9
  Top 0.813: ARDUINO_FOOTPRINT.10 55.27,54.17 57.72,56.62 57.72,60.9 JP4.1
SCL
  Bottom 0.61: R2K2_SCL.2 51.1,42.91 U1.6
  Bottom 0.813: ARDUINO_FOOTPRINT.21 97.32,45.9 85.7,45.9 84.3,47.3 52.5,47.3 51.1,45.9 U1.6
SDA
  Bottom 0.61: R2K2_SDA.2 48.56,43.24 48.56,44.3 U1.5
  Bottom 0.813: ARDUINO_FOOTPRINT.20 96.08,47.2 86.3,47.2 84.9,48.6 50.9,48.6 48.56,46.26 48.56,44.3
SHCP
  Top 0.813: ARDUINO_FOOTPRINT.5 71.6,55.73 71.6,68.3 68.7,71.2 67.1,71.2 65.34,69.44 JP4.8
SIM_NETLIGHT  (via drill 0.5)
  Top 0.61: IC1.P$52 11.62,59.88 v11.6,59.9
  Bottom 0.61: v11.6,59.9 10.4,61.1 9.3,61.1 8.61,61.79 R27-1K.2
SIM_PWRKEY
  Top 0.61: IC1.P$1 10.38,38.42 S1.1
  Bottom 0.61: T9.C 4.6,44.01 4.6,43.2 5.5,42.3 5.5,39.6 2.31,36.41 S1.2 S1.1
SIM_RESET  (via drill 0.5)
  Top 0.61: v31,40.2 31,38.44 IC1.P$16
  Bottom 0.61: T3.C 11,45.2 11.4,44.8 11.4,43.5 14.9,40.2 v31,40.2
SIM_RX
  Top 0.406: IC1.P$10 25.02,36.03 R5-2K.2 25.29,36 R1-1K.1 26.82,36.02
SIM_STATUS  (via drill 0.6)
  Top 0.61: v13.99,44.82 IC1.P$66
  Bottom 0.61: R23-1K.2 17.02,61.68 17.7,61 17.7,54.9 18,54.6 18.9,54.6 19.4,54.1 19.4,45.4 18.82,44.82 v13.99,44.82
SIM_TX  (via drill 0.6)
  Top 0.406: IC1.P$9 24.02,37.02 23.5,36.5
  Top 0.61: 23.5,36.5 23.5,33 24.4,32.1 30.8,32.1 38.9,24 v83.5,24 | v98.1,29.7 v98.1,37.8 | v98.1,43.6 98.1,48.7 94.89,51.91 ARDUINO_FOOTPRINT.17
  Bottom 0.61: v83.5,24 86.4,24 92.1,29.7 v98.1,29.7 | v98.1,37.8 v98.1,43.6
SR_DS  (via drill 0.6)
  Top 0.406: v49.2,64.8 50.7,64.8 51.3,64.2 51.3,62.4 51.13,62.23 IC2.6
  Top 0.813: JP4.4 60.26,70.3 63.56,73.6 70.2,73.6 74,69.8 74,54.19 ARDUINO_FOOTPRINT.3
  Bottom 0.406: JP4.4 60.26,71.2 55.6,71.2 v49.2,64.8
STATE_A  (via drill 0.6)
  Top 0.61: ARDUINO_FOOTPRINT.A3 77.12,4.12 76.7,3.7 48.9,3.7 47,5.6 42.6,5.6 40.5,7.7 v40.5,13.2 | A-GRN.C 37.55,17.49 MODE_SELECT.3
  Bottom 0.61: MODE_SELECT.3 37.47,16.23 v40.5,13.2
STATE_B  (via drill 0.6)
  Top 0.61: ARDUINO_FOOTPRINT.A4 79.66,3.76 77.9,2 33.5,2 31,4.5 v31,15 | B-YLW.C 34.95,17.43 MODE_SELECT.4
  Bottom 0.61: MODE_SELECT.4 33.41,17.41 v31,15
STCP
  Top 0.813: ARDUINO_FOOTPRINT.4 72.8,54.39 72.8,69.1 69.5,72.4 65,72.4 62.8,70.2 JP4.6
TRITRONIK
  cutout Top: 10.3,4.8 8.9,4.5 9.2,3.5 arc90 8.3,2.6 8.3,2.3 9.1,3.2 9.3,3.2 9.9,1.5 10.2,3.3 11,3.4 11,3.6 10.2,3.5
USIM_CLK  (via drill 0.5, 0.6)
  Top 0.406: v27.43,15.71 SIM_HOLDER.CLK
  Top 0.61: v38.5,30.8 39.3,31.6 39.3,56.82 v39.44,56.96
  Top 0.813: SIM_HOLDER.CLK v30.35,17.43
  Bottom 0.305: D15.4 21,18.43
  Bottom 0.406: 21,18.43 21,17.2 22.5,15.71 v27.43,15.71
  Bottom 0.61: R10-22.2 v39.44,56.96
  Bottom 0.813: v38.5,30.8 38.5,24.9 35.1,21.5 33.4,21.5 30.35,18.45 v30.35,17.43
USIM_DATA  (via drill 0.6)
  Top 0.406: v16.2,22.7 16.2,24.5 14.62,26.07
  Top 0.813: v27.8,26.2 14.75,26.2 14.62,26.07 5.98,17.43 SIM_HOLDER.I/O
  Bottom 0.305: D15.1 18.66,21.34 18.2,21.8
  Bottom 0.406: 18.2,21.8 17.1,21.8 v16.2,22.7
  Bottom 0.813: R11-22.2 38.24,55.46 38.7,55 38.7,33.9 37,32.2 37,25.8 35.4,24.2 31,24.2 29,26.2 v27.8,26.2
USIM_RESET  (via drill 0.6)
  Top 0.61: v35.5,33.5 38.2,36.2 38.2,58.8 v38.6,59.2 | v21.34,22.53 22.61,22.53 25.16,19.98 SIM_HOLDER.RST 28.78,19.98 v34.9,26.1
  Bottom 0.305: v21.34,22.53 20.16,21.35 D15.3
  Bottom 0.61: R9-22.2 38.19,58.51 38.2,58.5 38.2,58.8 v38.6,59.2 | v35.5,33.5 35.5,26.7 v34.9,26.1
USIM_VCC  (via drill 0.6)
  Top 0.406: 31.8,52.4 31.8,53.5 32.3,54 v33.3,54
  Top 0.61: v33.3,54 34,54 34.8,54.8 36.4,54.8 IC1.P$30 | 31.8,52.4 31.8,50.1 32.4,49.5 34.2,49.5 34.5,49.2 34.5,35.4 v34.8,35.1 | v15.17,20.93 17.01,20.94 20.57,24.5 23,24.5 24.98,22.52 SIM_HOLDER.VCC 28.52,22.52 v33.5,27.5
  Bottom 0.305: D15.5 19.41,16.78
  Bottom 0.406: 19.41,16.78 CSIM_100N.2
  Bottom 0.61: v33.3,54 33.41,54.01 C9.1 C11.1 | v33.5,27.5 34.3,28.3 34.3,34.6 v34.8,35.1 | v15.17,20.93 v15.16,20.93 CSIM_22P.2 15.18,19.25 CSIM_100N.2
VCC  (via drill 0.6, 1)
  Top 0.61: U1.8 56.18,50.22 54.9,51.5 41.5,51.5 40.7,52.3 40.7,54.9 41.9,56.1 44.7,56.1 48.3,59.7 IC2.8
  Top 0.813: R5.2 R4.2 41.75,3.75 v42.2,3.3
  Top 1.676: v82,15 80.4,13.4 57.9,13.4 56.8,12.3 ARDUINO_FOOTPRINT.5V@0 | DC2DC-2.VOUT 93.26,44.1 93.26,40.7 | ARDUINO_FOOTPRINT.5V@2 ARDUINO_FOOTPRINT.5V@1 111.94,53.64 109.4,51.1 v109.4,50.8 109.4,48.3 101.8,40.7 93.26,40.7 | 93.26,40.7 93.26,15.06 v93.2,15
  Bottom 0.61: R2K2_SDA.1 49.28,40.82 R2K2_SCL.1 53.82,40.82 56.2,43.2 56.2,44.81 U1.8
  Bottom 0.813: v42.2,3.3 55.9,3.3 56.8,4.2 ARDUINO_FOOTPRINT.5V@0
  Bottom 1.27: v82,15 80,17 80,35.5 70.67,44.83 U1.8
  Bottom 1.676: v93.2,15 v82,15

### Text on the board
Top: VERSION 4 | HA CONTROLLER | M2M Tritronik